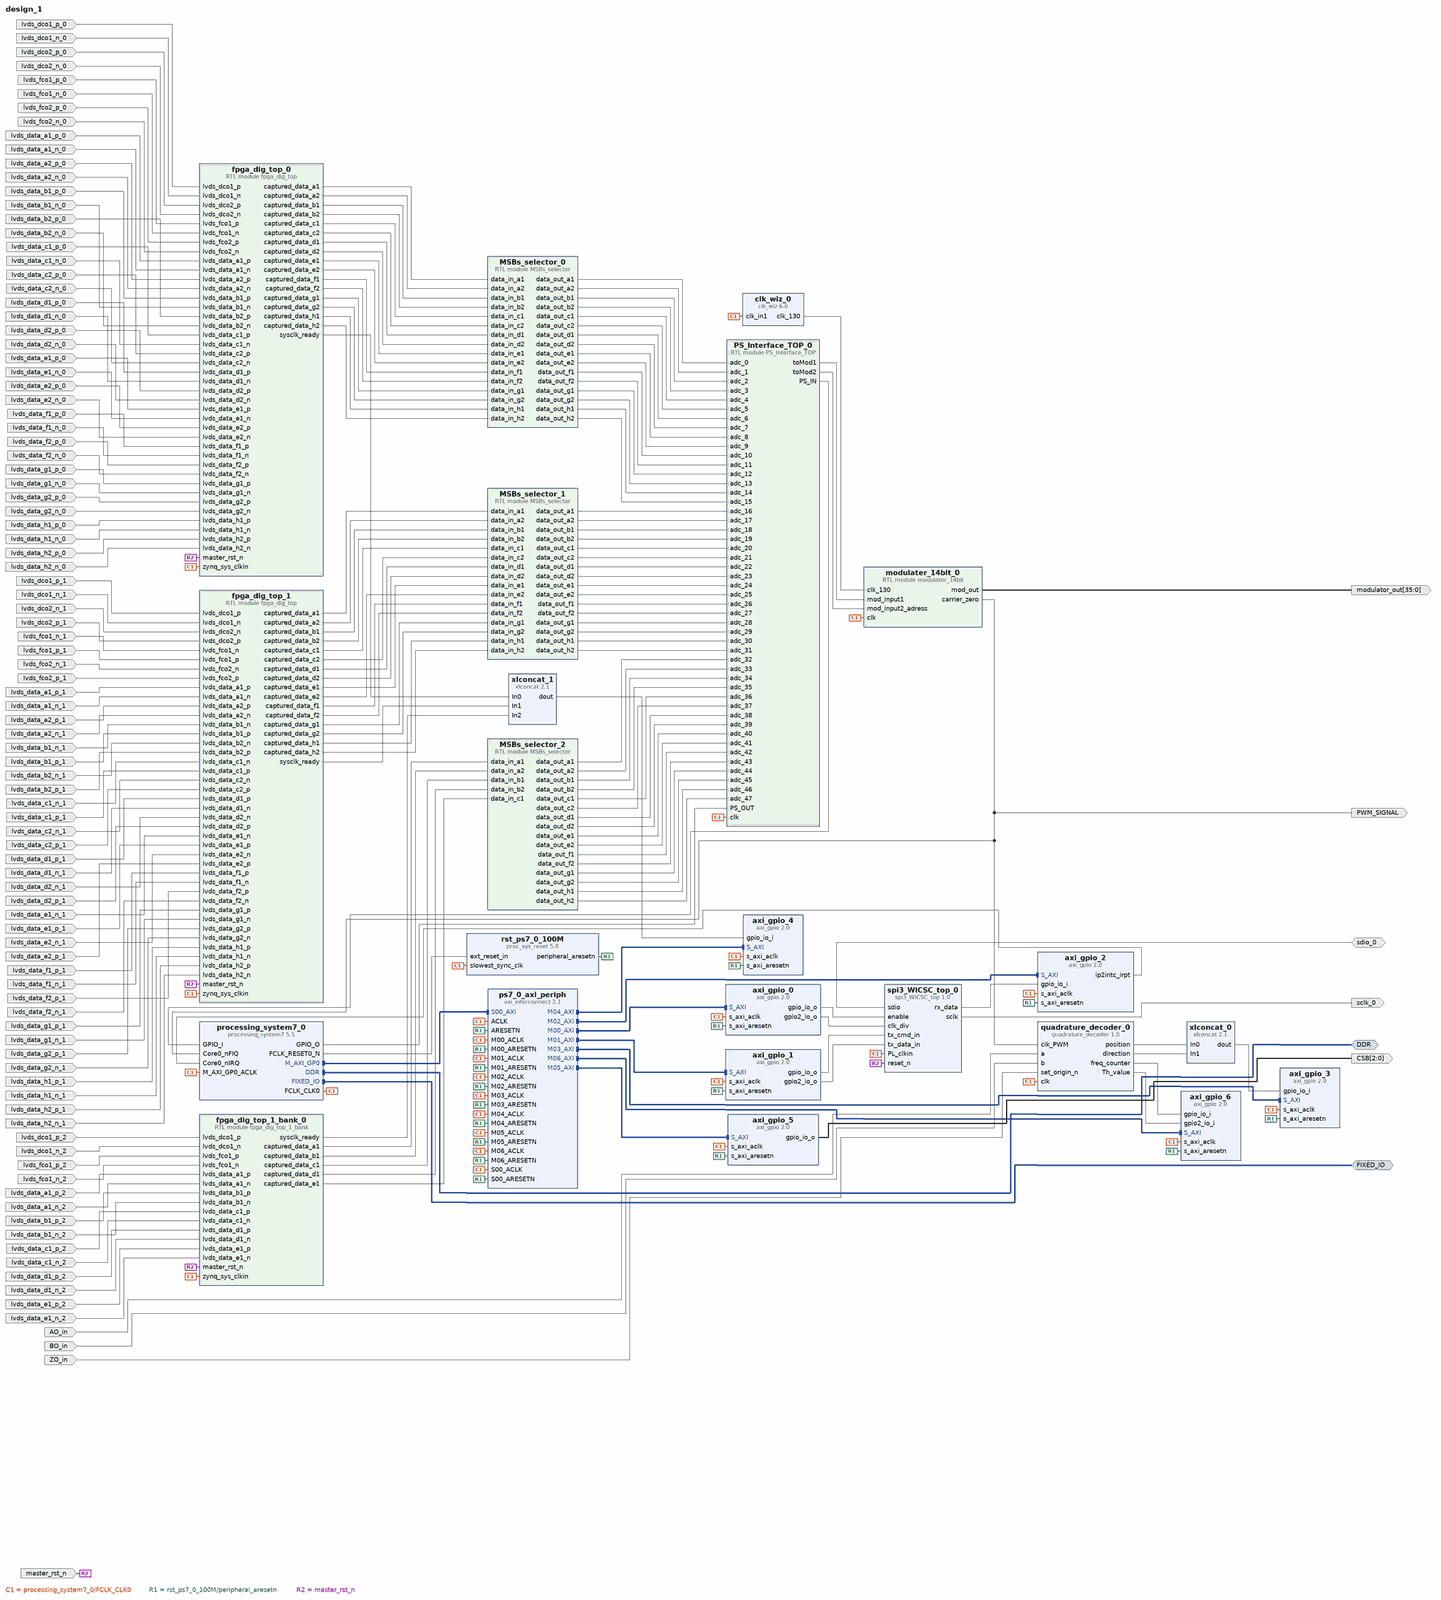
[diagram p0: block diagram of the top level, whole]
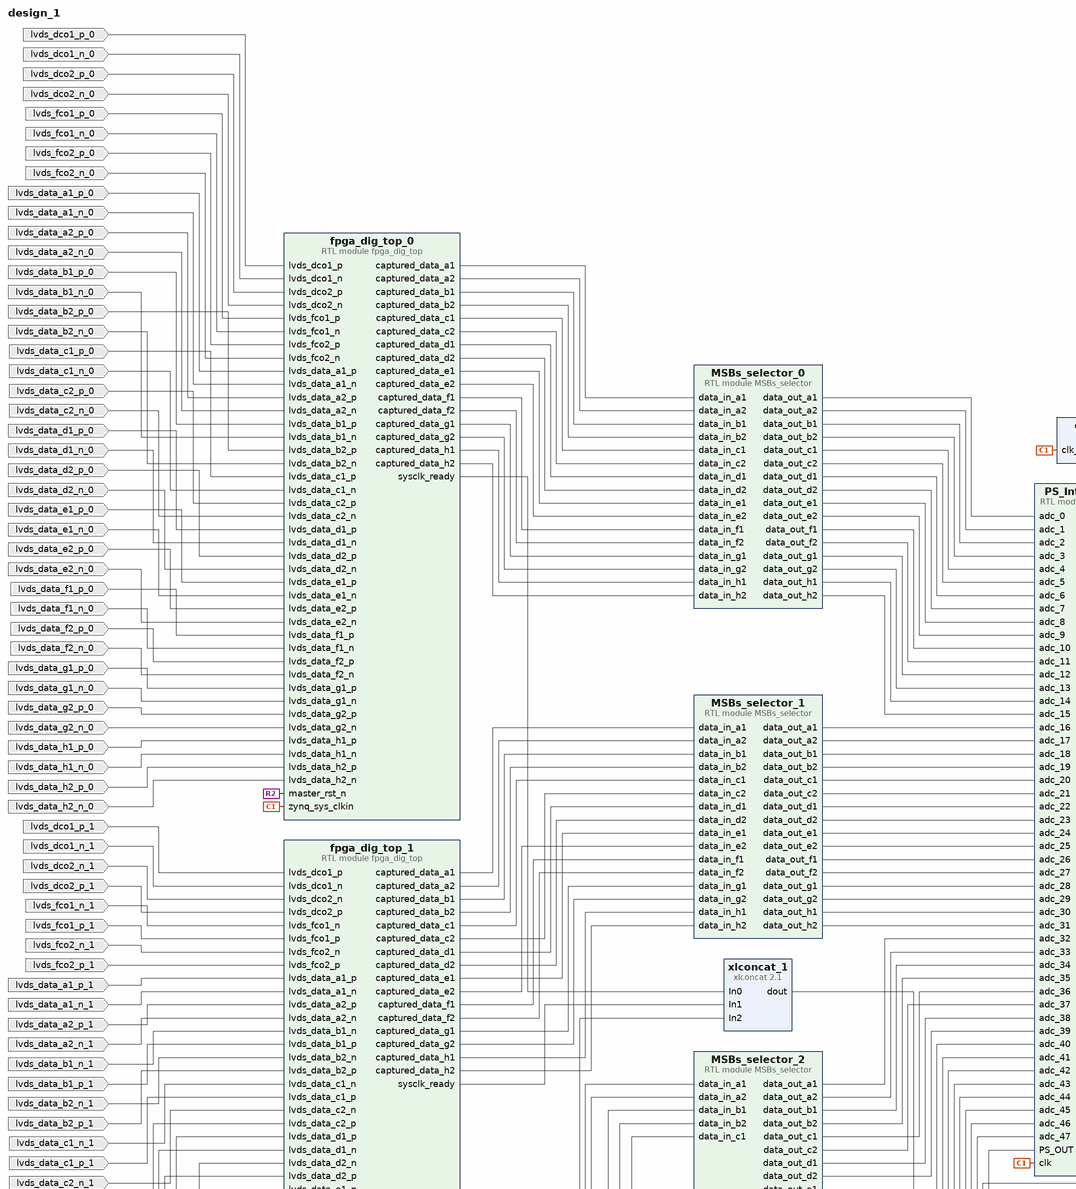
[diagram p1: block diagram of the top level, upper left part]
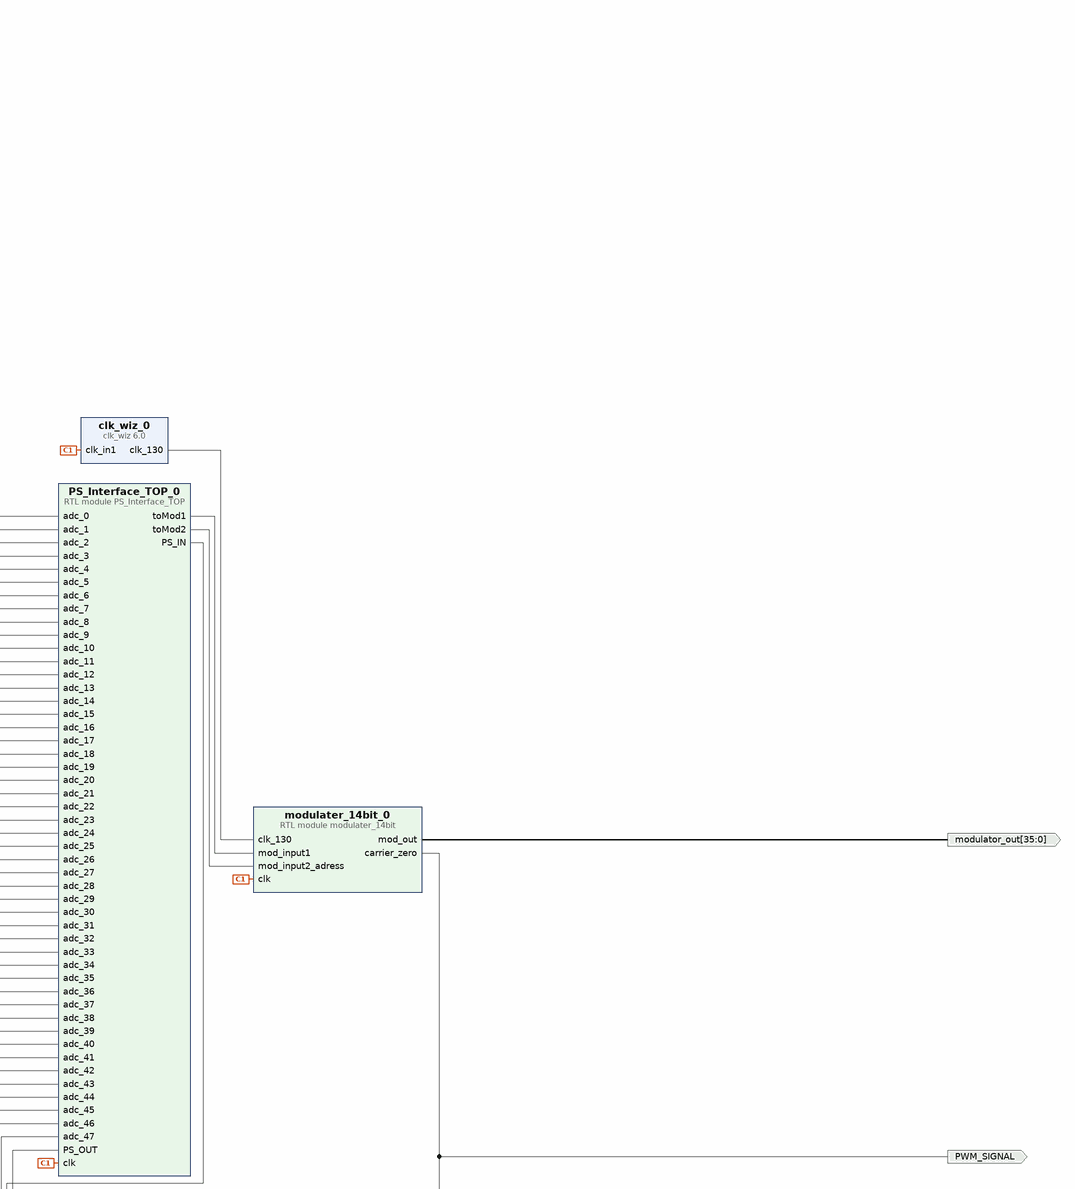
[diagram p2: block diagram of the top level, upper right part]
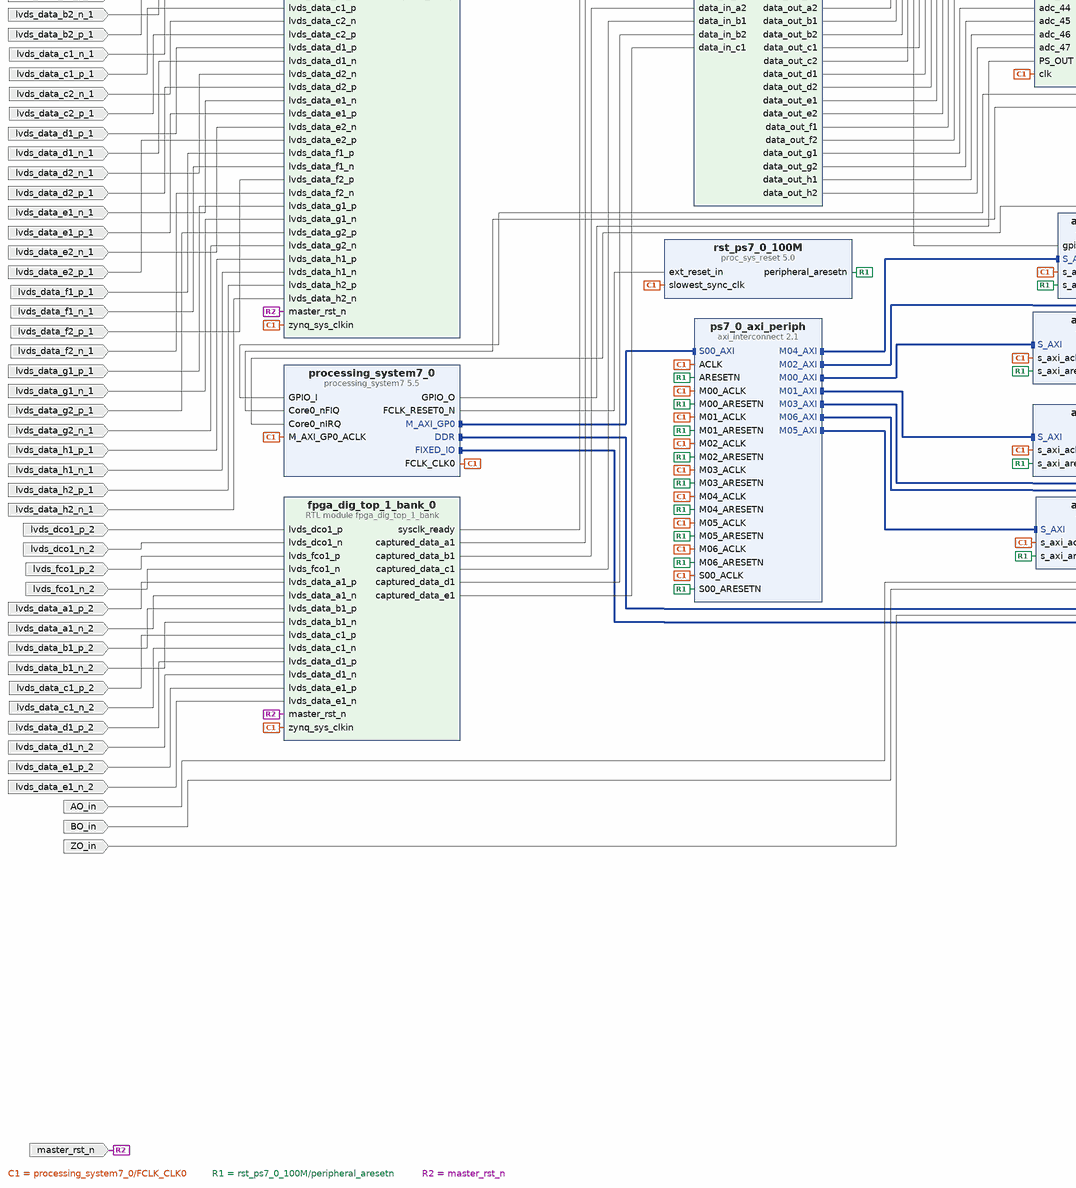
[diagram p3: block diagram of the top level, lower left part]
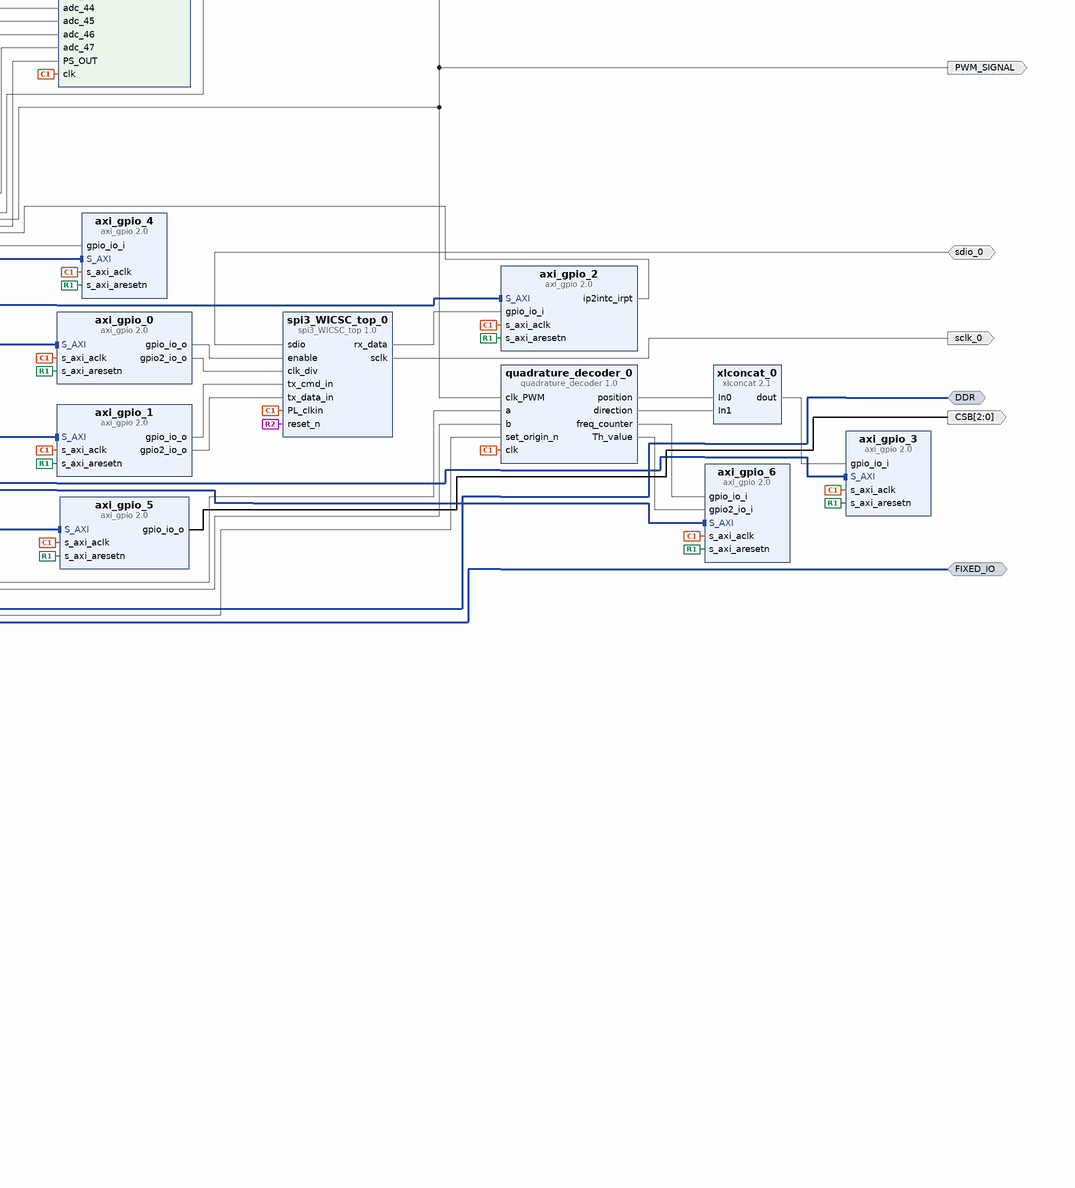
[diagram p4: block diagram of the top level, lower right part]
# Vivado block design design_1, xc7z045ffg900-2, Vivado 2020.1
create_bd_design design_1

create_bd_intf_port -mode Master -vlnv xilinx.com:interface:ddrx_rtl:1.0 DDR
create_bd_intf_port -mode Master -vlnv xilinx.com:display_processing_system7:fixedio_rtl:1.0 FIXED_IO
create_bd_port -dir I AO_in
create_bd_port -dir I BO_in
create_bd_port -dir I ZO_in
create_bd_port -dir I lvds_dco1_p_0
create_bd_port -dir I lvds_dco1_n_0
create_bd_port -dir I lvds_dco2_p_0
create_bd_port -dir I lvds_dco2_n_0
create_bd_port -dir I lvds_fco1_p_0
create_bd_port -dir I lvds_fco1_n_0
create_bd_port -dir I lvds_fco2_p_0
create_bd_port -dir I lvds_fco2_n_0
create_bd_port -dir I lvds_data_a1_p_0
create_bd_port -dir I lvds_data_a1_n_0
create_bd_port -dir I lvds_data_a2_p_0
create_bd_port -dir I lvds_data_a2_n_0
create_bd_port -dir I lvds_data_b1_p_0
create_bd_port -dir I lvds_data_b1_n_0
create_bd_port -dir I lvds_data_b2_p_0
create_bd_port -dir I lvds_data_b2_n_0
create_bd_port -dir I lvds_data_c1_p_0
create_bd_port -dir I lvds_data_c1_n_0
create_bd_port -dir I lvds_data_c2_p_0
create_bd_port -dir I lvds_data_c2_n_0
create_bd_port -dir I lvds_data_d1_p_0
create_bd_port -dir I lvds_data_d1_n_0
create_bd_port -dir I lvds_data_d2_p_0
create_bd_port -dir I lvds_data_d2_n_0
create_bd_port -dir I lvds_data_e1_p_0
create_bd_port -dir I lvds_data_e1_n_0
create_bd_port -dir I lvds_data_e2_p_0
create_bd_port -dir I lvds_data_e2_n_0
create_bd_port -dir I lvds_data_f1_p_0
create_bd_port -dir I lvds_data_f1_n_0
create_bd_port -dir I lvds_data_f2_p_0
create_bd_port -dir I lvds_data_f2_n_0
create_bd_port -dir I lvds_data_g1_p_0
create_bd_port -dir I lvds_data_g1_n_0
create_bd_port -dir I lvds_data_g2_p_0
create_bd_port -dir I lvds_data_g2_n_0
create_bd_port -dir I lvds_data_h1_p_0
create_bd_port -dir I lvds_data_h1_n_0
create_bd_port -dir I lvds_data_h2_p_0
create_bd_port -dir I lvds_data_h2_n_0
create_bd_port -dir I lvds_data_a1_n_1
create_bd_port -dir I lvds_data_a1_p_1
create_bd_port -dir I lvds_data_a2_n_1
create_bd_port -dir I lvds_data_a2_p_1
create_bd_port -dir I lvds_data_b1_n_1
create_bd_port -dir I lvds_data_b1_p_1
create_bd_port -dir I lvds_data_b2_n_1
create_bd_port -dir I lvds_data_b2_p_1
create_bd_port -dir I lvds_data_c1_n_1
create_bd_port -dir I lvds_data_c1_p_1
create_bd_port -dir I lvds_data_c2_n_1
create_bd_port -dir I lvds_data_c2_p_1
create_bd_port -dir I lvds_data_d1_n_1
create_bd_port -dir I lvds_data_d1_p_1
create_bd_port -dir I lvds_data_d2_n_1
create_bd_port -dir I lvds_data_d2_p_1
create_bd_port -dir I lvds_data_e1_n_1
create_bd_port -dir I lvds_data_e1_p_1
create_bd_port -dir I lvds_data_e2_n_1
create_bd_port -dir I lvds_data_e2_p_1
create_bd_port -dir I lvds_data_f1_n_1
create_bd_port -dir I lvds_data_f1_p_1
create_bd_port -dir I lvds_data_f2_n_1
create_bd_port -dir I lvds_data_f2_p_1
create_bd_port -dir I lvds_data_g1_n_1
create_bd_port -dir I lvds_data_g1_p_1
create_bd_port -dir I lvds_data_g2_n_1
create_bd_port -dir I lvds_data_g2_p_1
create_bd_port -dir I lvds_data_h1_n_1
create_bd_port -dir I lvds_data_h1_p_1
create_bd_port -dir I lvds_data_h2_n_1
create_bd_port -dir I lvds_data_h2_p_1
create_bd_port -dir I lvds_dco1_n_1
create_bd_port -dir I lvds_dco1_p_1
create_bd_port -dir I lvds_dco2_n_1
create_bd_port -dir I lvds_dco2_p_1
create_bd_port -dir I lvds_fco1_n_1
create_bd_port -dir I lvds_fco1_p_1
create_bd_port -dir I lvds_fco2_n_1
create_bd_port -dir I lvds_fco2_p_1
create_bd_port -dir I lvds_data_a1_n_2
create_bd_port -dir I lvds_data_a1_p_2
create_bd_port -dir I lvds_data_d1_n_2
create_bd_port -dir I lvds_data_d1_p_2
create_bd_port -dir I lvds_data_b1_n_2
create_bd_port -dir I lvds_data_b1_p_2
create_bd_port -dir I lvds_data_e1_n_2
create_bd_port -dir I lvds_data_e1_p_2
create_bd_port -dir I lvds_data_c1_n_2
create_bd_port -dir I lvds_data_c1_p_2
create_bd_port -dir I lvds_dco1_n_2
create_bd_port -dir I lvds_dco1_p_2
create_bd_port -dir I lvds_fco1_n_2
create_bd_port -dir I lvds_fco1_p_2
create_bd_port -dir IO sdio_0
create_bd_port -dir O sclk_0
create_bd_port -dir I master_rst_n
create_bd_port -dir O -from 35 -to 0 modulator_out
create_bd_port -dir O -from 2 -to 0 CSB
create_bd_port -dir O -type data PWM_SIGNAL

create_bd_cell -type ip -vlnv xilinx.com:ip:processing_system7:5.5 processing_system7_0
set_property -dict [list \
  CONFIG.PCW_APU_PERIPHERAL_FREQMHZ 667.000000 \
  CONFIG.PCW_CORE0_FIQ_INTR 1 \
  CONFIG.PCW_CORE0_IRQ_INTR 1 \
  CONFIG.PCW_DUAL_PARALLEL_QSPI_DATA_MODE x8 \
  CONFIG.PCW_ENET0_ENET0_IO {MIO 16 .. 27} \
  CONFIG.PCW_ENET0_GRP_MDIO_ENABLE 1 \
  CONFIG.PCW_ENET0_GRP_MDIO_IO {MIO 52 .. 53} \
  CONFIG.PCW_ENET0_PERIPHERAL_ENABLE 1 \
  CONFIG.PCW_ENET0_PERIPHERAL_FREQMHZ {100 Mbps} \
  CONFIG.PCW_ENET0_RESET_ENABLE 1 \
  CONFIG.PCW_ENET0_RESET_IO {MIO 47} \
  CONFIG.PCW_ENET_RESET_ENABLE 1 \
  CONFIG.PCW_ENET_RESET_SELECT {Share reset pin} \
  CONFIG.PCW_FPGA0_PERIPHERAL_FREQMHZ 100 \
  CONFIG.PCW_GPIO_EMIO_GPIO_ENABLE 1 \
  CONFIG.PCW_GPIO_EMIO_GPIO_IO 64 \
  CONFIG.PCW_GPIO_MIO_GPIO_ENABLE 1 \
  CONFIG.PCW_GPIO_MIO_GPIO_IO MIO \
  CONFIG.PCW_I2C0_GRP_INT_ENABLE 0 \
  CONFIG.PCW_I2C0_I2C0_IO {MIO 50 .. 51} \
  CONFIG.PCW_I2C0_PERIPHERAL_ENABLE 1 \
  CONFIG.PCW_I2C0_RESET_ENABLE 1 \
  CONFIG.PCW_I2C0_RESET_IO {MIO 46} \
  CONFIG.PCW_I2C_PERIPHERAL_FREQMHZ 111.111115 \
  CONFIG.PCW_I2C_RESET_ENABLE 1 \
  CONFIG.PCW_I2C_RESET_SELECT {Share reset pin} \
  CONFIG.PCW_PRESET_BANK0_VOLTAGE {LVCMOS 1.8V} \
  CONFIG.PCW_PRESET_BANK1_VOLTAGE {LVCMOS 1.8V} \
  CONFIG.PCW_QSPI_GRP_FBCLK_ENABLE 1 \
  CONFIG.PCW_QSPI_GRP_FBCLK_IO {MIO 8} \
  CONFIG.PCW_QSPI_GRP_IO1_ENABLE 1 \
  CONFIG.PCW_QSPI_GRP_IO1_IO {MIO 0 9 .. 13} \
  CONFIG.PCW_QSPI_GRP_SINGLE_SS_ENABLE 0 \
  CONFIG.PCW_QSPI_INTERNAL_HIGHADDRESS 0xFDFFFFFF \
  CONFIG.PCW_QSPI_PERIPHERAL_ENABLE 1 \
  CONFIG.PCW_QSPI_QSPI_IO {MIO 1 .. 6} \
  CONFIG.PCW_SD0_GRP_CD_ENABLE 1 \
  CONFIG.PCW_SD0_GRP_CD_IO {MIO 14} \
  CONFIG.PCW_SD0_GRP_WP_ENABLE 1 \
  CONFIG.PCW_SD0_GRP_WP_IO {MIO 15} \
  CONFIG.PCW_SD0_PERIPHERAL_ENABLE 1 \
  CONFIG.PCW_SD0_SD0_IO {MIO 40 .. 45} \
  CONFIG.PCW_SDIO_PERIPHERAL_FREQMHZ 50 \
  CONFIG.PCW_TTC0_PERIPHERAL_ENABLE 1 \
  CONFIG.PCW_TTC0_TTC0_IO EMIO \
  CONFIG.PCW_UART1_PERIPHERAL_ENABLE 1 \
  CONFIG.PCW_UART1_UART1_IO {MIO 48 .. 49} \
  CONFIG.PCW_UART_PERIPHERAL_FREQMHZ 50 \
  CONFIG.PCW_UIPARAM_DDR_FREQ_MHZ 533.333313 \
  CONFIG.PCW_UIPARAM_DDR_PARTNO Custom \
  CONFIG.PCW_USB0_PERIPHERAL_ENABLE 1 \
  CONFIG.PCW_USB0_RESET_ENABLE 1 \
  CONFIG.PCW_USB0_RESET_IO {MIO 7} \
  CONFIG.PCW_USB0_USB0_IO {MIO 28 .. 39} \
  CONFIG.PCW_USB_RESET_ENABLE 1 \
  CONFIG.PCW_USB_RESET_SELECT {Share reset pin} \
  CONFIG.PCW_USE_FABRIC_INTERRUPT 1 \
  CONFIG.preset ZC706 \
] [get_bd_cells processing_system7_0]
# 236 more settings of processing_system7_0 are not shown: defaults, MIO pin electricals, DDR timing, and values the tool derives
create_bd_cell -type module -reference fpga_dig_top fpga_dig_top_0
create_bd_cell -type ip -vlnv kth.se:user:spi3_WICSC_top:1.0 spi3_WICSC_top_0
create_bd_cell -type ip -vlnv xilinx.com:ip:axi_gpio:2.0 axi_gpio_0
set_property -dict [list \
  CONFIG.C_ALL_OUTPUTS 1 \
  CONFIG.C_ALL_OUTPUTS_2 1 \
  CONFIG.C_GPIO_WIDTH 1 \
  CONFIG.C_IS_DUAL 1 \
] [get_bd_cells axi_gpio_0]
create_bd_cell -type ip -vlnv xilinx.com:ip:axi_gpio:2.0 axi_gpio_1
set_property -dict [list \
  CONFIG.C_ALL_OUTPUTS 1 \
  CONFIG.C_ALL_OUTPUTS_2 1 \
  CONFIG.C_GPIO2_WIDTH 8 \
  CONFIG.C_GPIO_WIDTH 16 \
  CONFIG.C_IS_DUAL 1 \
] [get_bd_cells axi_gpio_1]
create_bd_cell -type ip -vlnv xilinx.com:ip:axi_gpio:2.0 axi_gpio_2
set_property -dict {CONFIG.C_ALL_INPUTS 1 CONFIG.C_GPIO_WIDTH 8 CONFIG.C_INTERRUPT_PRESENT 1} [get_bd_cells axi_gpio_2]
create_bd_cell -type ip -vlnv xilinx.com:ip:axi_interconnect:2.1 ps7_0_axi_periph
set_property -dict {CONFIG.NUM_MI 7} [get_bd_cells ps7_0_axi_periph]
create_bd_cell -type ip -vlnv xilinx.com:ip:proc_sys_reset:5.0 rst_ps7_0_100M
create_bd_cell -type module -reference PS_Interface_TOP PS_Interface_TOP_0
create_bd_cell -type module -reference modulater_14bit modulater_14bit_0
create_bd_cell -type ip -vlnv xilinx.com:ip:clk_wiz:6.0 clk_wiz_0
set_property -dict [list \
  CONFIG.CLKOUT1_JITTER 231.118 \
  CONFIG.CLKOUT1_PHASE_ERROR 297.890 \
  CONFIG.CLKOUT1_REQUESTED_OUT_FREQ 130.000 \
  CONFIG.CLK_OUT1_PORT clk_130 \
  CONFIG.MMCM_CLKFBOUT_MULT_F 50.375 \
  CONFIG.MMCM_CLKOUT0_DIVIDE_F 7.750 \
  CONFIG.MMCM_DIVCLK_DIVIDE 5 \
] [get_bd_cells clk_wiz_0]
create_bd_cell -type ip -vlnv xilinx.com:ip:axi_gpio:2.0 axi_gpio_3
set_property -dict {CONFIG.C_ALL_INPUTS 1 CONFIG.C_GPIO_WIDTH 17} [get_bd_cells axi_gpio_3]
create_bd_cell -type ip -vlnv xilinx.com:ip:xlconcat:2.1 xlconcat_0
set_property -dict {CONFIG.IN0_WIDTH 16 CONFIG.IN1_WIDTH 1} [get_bd_cells xlconcat_0]
create_bd_cell -type module -reference fpga_dig_top fpga_dig_top_1
create_bd_cell -type module -reference MSBs_selector MSBs_selector_0
create_bd_cell -type module -reference MSBs_selector MSBs_selector_1
create_bd_cell -type module -reference MSBs_selector MSBs_selector_2
create_bd_cell -type ip -vlnv xilinx.com:ip:axi_gpio:2.0 axi_gpio_4
set_property -dict {CONFIG.C_ALL_INPUTS 1 CONFIG.C_GPIO_WIDTH 3} [get_bd_cells axi_gpio_4]
create_bd_cell -type ip -vlnv xilinx.com:ip:xlconcat:2.1 xlconcat_1
set_property -dict {CONFIG.IN0_WIDTH 1 CONFIG.IN1_WIDTH 1 CONFIG.IN2_WIDTH 1 CONFIG.NUM_PORTS 3} [get_bd_cells xlconcat_1]
create_bd_cell -type module -reference fpga_dig_top_1_bank fpga_dig_top_1_bank_0
create_bd_cell -type ip -vlnv xilinx.com:ip:axi_gpio:2.0 axi_gpio_5
set_property -dict {CONFIG.C_ALL_OUTPUTS 1 CONFIG.C_DOUT_DEFAULT 0x00000003 CONFIG.C_GPIO_WIDTH 3} [get_bd_cells axi_gpio_5]
create_bd_cell -type ip -vlnv kth.se:user:quadrature_decoder:1.0 quadrature_decoder_0
set_property -dict {CONFIG.debounce_time 50000 CONFIG.set_origin_debounce_time 500000} [get_bd_cells quadrature_decoder_0]
create_bd_cell -type ip -vlnv xilinx.com:ip:axi_gpio:2.0 axi_gpio_6
set_property -dict {CONFIG.C_ALL_INPUTS 1 CONFIG.C_ALL_INPUTS_2 1 CONFIG.C_IS_DUAL 1} [get_bd_cells axi_gpio_6]

# ---- connections ----

connect_bd_intf_net [get_bd_intf_pins ps7_0_axi_periph/M02_AXI] [get_bd_intf_pins axi_gpio_2/S_AXI]
connect_bd_intf_net [get_bd_intf_pins ps7_0_axi_periph/M04_AXI] [get_bd_intf_pins axi_gpio_4/S_AXI]
connect_bd_intf_net [get_bd_intf_ports DDR] [get_bd_intf_pins processing_system7_0/DDR]
connect_bd_intf_net [get_bd_intf_pins ps7_0_axi_periph/M01_AXI] [get_bd_intf_pins axi_gpio_1/S_AXI]
connect_bd_intf_net [get_bd_intf_pins ps7_0_axi_periph/M00_AXI] [get_bd_intf_pins axi_gpio_0/S_AXI]
connect_bd_intf_net [get_bd_intf_pins ps7_0_axi_periph/M03_AXI] [get_bd_intf_pins axi_gpio_3/S_AXI]
connect_bd_intf_net [get_bd_intf_ports FIXED_IO] [get_bd_intf_pins processing_system7_0/FIXED_IO]
connect_bd_intf_net [get_bd_intf_pins ps7_0_axi_periph/M06_AXI] [get_bd_intf_pins axi_gpio_6/S_AXI]
connect_bd_intf_net [get_bd_intf_pins processing_system7_0/M_AXI_GP0] [get_bd_intf_pins ps7_0_axi_periph/S00_AXI]
connect_bd_intf_net [get_bd_intf_pins ps7_0_axi_periph/M05_AXI] [get_bd_intf_pins axi_gpio_5/S_AXI]
connect_bd_net [get_bd_pins processing_system7_0/FCLK_CLK0] \
  [get_bd_pins spi3_WICSC_top_0/PL_clkin] [get_bd_pins processing_system7_0/M_AXI_GP0_ACLK] \
  [get_bd_pins ps7_0_axi_periph/S00_ACLK] [get_bd_pins rst_ps7_0_100M/slowest_sync_clk] [get_bd_pins axi_gpio_0/s_axi_aclk] \
  [get_bd_pins ps7_0_axi_periph/M00_ACLK] [get_bd_pins ps7_0_axi_periph/ACLK] [get_bd_pins axi_gpio_1/s_axi_aclk] \
  [get_bd_pins ps7_0_axi_periph/M01_ACLK] [get_bd_pins axi_gpio_2/s_axi_aclk] [get_bd_pins ps7_0_axi_periph/M02_ACLK] \
  [get_bd_pins fpga_dig_top_0/zynq_sys_clkin] [get_bd_pins PS_Interface_TOP_0/clk] [get_bd_pins clk_wiz_0/clk_in1] \
  [get_bd_pins modulater_14bit_0/clk] [get_bd_pins axi_gpio_3/s_axi_aclk] [get_bd_pins ps7_0_axi_periph/M03_ACLK] \
  [get_bd_pins fpga_dig_top_1/zynq_sys_clkin] [get_bd_pins axi_gpio_4/s_axi_aclk] [get_bd_pins ps7_0_axi_periph/M04_ACLK] \
  [get_bd_pins fpga_dig_top_1_bank_0/zynq_sys_clkin] [get_bd_pins quadrature_decoder_0/clk] \
  [get_bd_pins axi_gpio_5/s_axi_aclk] [get_bd_pins ps7_0_axi_periph/M05_ACLK] [get_bd_pins axi_gpio_6/s_axi_aclk] \
  [get_bd_pins ps7_0_axi_periph/M06_ACLK]
connect_bd_net [get_bd_pins axi_gpio_0/gpio_io_o] [get_bd_pins spi3_WICSC_top_0/enable]
connect_bd_net [get_bd_pins axi_gpio_0/gpio2_io_o] [get_bd_pins spi3_WICSC_top_0/clk_div]
connect_bd_net [get_bd_pins axi_gpio_1/gpio_io_o] [get_bd_pins spi3_WICSC_top_0/tx_cmd_in]
connect_bd_net [get_bd_pins axi_gpio_1/gpio2_io_o] [get_bd_pins spi3_WICSC_top_0/tx_data_in]
connect_bd_net [get_bd_pins spi3_WICSC_top_0/rx_data] [get_bd_pins axi_gpio_2/gpio_io_i]
connect_bd_net [get_bd_pins processing_system7_0/FCLK_RESET0_N] [get_bd_pins rst_ps7_0_100M/ext_reset_in]
connect_bd_net [get_bd_pins rst_ps7_0_100M/peripheral_aresetn] \
  [get_bd_pins ps7_0_axi_periph/S00_ARESETN] [get_bd_pins axi_gpio_0/s_axi_aresetn] \
  [get_bd_pins ps7_0_axi_periph/M00_ARESETN] [get_bd_pins ps7_0_axi_periph/ARESETN] [get_bd_pins axi_gpio_1/s_axi_aresetn] \
  [get_bd_pins ps7_0_axi_periph/M01_ARESETN] [get_bd_pins axi_gpio_2/s_axi_aresetn] \
  [get_bd_pins ps7_0_axi_periph/M02_ARESETN] [get_bd_pins axi_gpio_3/s_axi_aresetn] \
  [get_bd_pins ps7_0_axi_periph/M03_ARESETN] [get_bd_pins axi_gpio_4/s_axi_aresetn] \
  [get_bd_pins ps7_0_axi_periph/M04_ARESETN] [get_bd_pins axi_gpio_5/s_axi_aresetn] \
  [get_bd_pins ps7_0_axi_periph/M05_ARESETN] [get_bd_pins axi_gpio_6/s_axi_aresetn] \
  [get_bd_pins ps7_0_axi_periph/M06_ARESETN]
connect_bd_net [get_bd_pins PS_Interface_TOP_0/PS_IN] [get_bd_pins processing_system7_0/GPIO_I]
connect_bd_net [get_bd_pins processing_system7_0/GPIO_O] [get_bd_pins PS_Interface_TOP_0/PS_OUT]
connect_bd_net [get_bd_pins clk_wiz_0/clk_130] [get_bd_pins modulater_14bit_0/clk_130]
connect_bd_net [get_bd_pins PS_Interface_TOP_0/toMod1] [get_bd_pins modulater_14bit_0/mod_input1]
connect_bd_net [get_bd_pins PS_Interface_TOP_0/toMod2] [get_bd_pins modulater_14bit_0/mod_input2_adress]
connect_bd_net [get_bd_pins modulater_14bit_0/carrier_zero] \
  [get_bd_pins processing_system7_0/Core0_nFIQ] [get_bd_pins quadrature_decoder_0/clk_PWM] [get_bd_ports PWM_SIGNAL]
connect_bd_net [get_bd_pins axi_gpio_2/ip2intc_irpt] [get_bd_pins processing_system7_0/Core0_nIRQ]
connect_bd_net [get_bd_pins fpga_dig_top_0/captured_data_a1] [get_bd_pins MSBs_selector_0/data_in_a1]
connect_bd_net [get_bd_pins fpga_dig_top_0/captured_data_a2] [get_bd_pins MSBs_selector_0/data_in_a2]
connect_bd_net [get_bd_pins fpga_dig_top_0/captured_data_b1] [get_bd_pins MSBs_selector_0/data_in_b1]
connect_bd_net [get_bd_pins fpga_dig_top_0/captured_data_b2] [get_bd_pins MSBs_selector_0/data_in_b2]
connect_bd_net [get_bd_pins fpga_dig_top_0/captured_data_c1] [get_bd_pins MSBs_selector_0/data_in_c1]
connect_bd_net [get_bd_pins fpga_dig_top_0/captured_data_c2] [get_bd_pins MSBs_selector_0/data_in_c2]
connect_bd_net [get_bd_pins fpga_dig_top_0/captured_data_d1] [get_bd_pins MSBs_selector_0/data_in_d1]
connect_bd_net [get_bd_pins fpga_dig_top_0/captured_data_d2] [get_bd_pins MSBs_selector_0/data_in_d2]
connect_bd_net [get_bd_pins fpga_dig_top_0/captured_data_e1] [get_bd_pins MSBs_selector_0/data_in_e1]
connect_bd_net [get_bd_pins fpga_dig_top_0/captured_data_e2] [get_bd_pins MSBs_selector_0/data_in_e2]
connect_bd_net [get_bd_pins fpga_dig_top_0/captured_data_f1] [get_bd_pins MSBs_selector_0/data_in_f1]
connect_bd_net [get_bd_pins fpga_dig_top_0/captured_data_f2] [get_bd_pins MSBs_selector_0/data_in_f2]
connect_bd_net [get_bd_pins fpga_dig_top_0/captured_data_g1] [get_bd_pins MSBs_selector_0/data_in_g1]
connect_bd_net [get_bd_pins fpga_dig_top_0/captured_data_g2] [get_bd_pins MSBs_selector_0/data_in_g2]
connect_bd_net [get_bd_pins fpga_dig_top_0/captured_data_h1] [get_bd_pins MSBs_selector_0/data_in_h1]
connect_bd_net [get_bd_pins fpga_dig_top_0/captured_data_h2] [get_bd_pins MSBs_selector_0/data_in_h2]
connect_bd_net [get_bd_pins MSBs_selector_0/data_out_a1] [get_bd_pins PS_Interface_TOP_0/adc_0]
connect_bd_net [get_bd_pins MSBs_selector_0/data_out_a2] [get_bd_pins PS_Interface_TOP_0/adc_1]
connect_bd_net [get_bd_pins MSBs_selector_0/data_out_b1] [get_bd_pins PS_Interface_TOP_0/adc_2]
connect_bd_net [get_bd_pins MSBs_selector_0/data_out_b2] [get_bd_pins PS_Interface_TOP_0/adc_3]
connect_bd_net [get_bd_pins MSBs_selector_0/data_out_c1] [get_bd_pins PS_Interface_TOP_0/adc_4]
connect_bd_net [get_bd_pins MSBs_selector_0/data_out_c2] [get_bd_pins PS_Interface_TOP_0/adc_5]
connect_bd_net [get_bd_pins MSBs_selector_0/data_out_d1] [get_bd_pins PS_Interface_TOP_0/adc_6]
connect_bd_net [get_bd_pins MSBs_selector_0/data_out_d2] [get_bd_pins PS_Interface_TOP_0/adc_7]
connect_bd_net [get_bd_pins MSBs_selector_0/data_out_e1] [get_bd_pins PS_Interface_TOP_0/adc_8]
connect_bd_net [get_bd_pins MSBs_selector_0/data_out_e2] [get_bd_pins PS_Interface_TOP_0/adc_9]
connect_bd_net [get_bd_pins MSBs_selector_0/data_out_f1] [get_bd_pins PS_Interface_TOP_0/adc_10]
connect_bd_net [get_bd_pins MSBs_selector_0/data_out_f2] [get_bd_pins PS_Interface_TOP_0/adc_11]
connect_bd_net [get_bd_pins MSBs_selector_0/data_out_g1] [get_bd_pins PS_Interface_TOP_0/adc_12]
connect_bd_net [get_bd_pins MSBs_selector_0/data_out_g2] [get_bd_pins PS_Interface_TOP_0/adc_13]
connect_bd_net [get_bd_pins MSBs_selector_0/data_out_h1] [get_bd_pins PS_Interface_TOP_0/adc_14]
connect_bd_net [get_bd_pins MSBs_selector_0/data_out_h2] [get_bd_pins PS_Interface_TOP_0/adc_15]
connect_bd_net [get_bd_pins quadrature_decoder_0/position] [get_bd_pins xlconcat_0/In0]
connect_bd_net [get_bd_pins quadrature_decoder_0/direction] [get_bd_pins xlconcat_0/In1]
connect_bd_net [get_bd_pins xlconcat_0/dout] [get_bd_pins axi_gpio_3/gpio_io_i]
connect_bd_net [get_bd_ports AO_in] [get_bd_pins quadrature_decoder_0/a]
connect_bd_net [get_bd_ports BO_in] [get_bd_pins quadrature_decoder_0/b]
connect_bd_net [get_bd_ports ZO_in] [get_bd_pins quadrature_decoder_0/set_origin_n]
connect_bd_net -net lvds_dco1_p_1_1 [get_bd_ports lvds_dco1_p_0] [get_bd_pins fpga_dig_top_0/lvds_dco1_p]
connect_bd_net -net lvds_dco1_n_1_1 [get_bd_ports lvds_dco1_n_0] [get_bd_pins fpga_dig_top_0/lvds_dco1_n]
connect_bd_net -net lvds_dco2_p_0_1 [get_bd_ports lvds_dco2_p_0] [get_bd_pins fpga_dig_top_0/lvds_dco2_p]
connect_bd_net -net lvds_dco2_n_0_1 [get_bd_ports lvds_dco2_n_0] [get_bd_pins fpga_dig_top_0/lvds_dco2_n]
connect_bd_net -net lvds_fco1_p_0_1 [get_bd_ports lvds_fco1_p_0] [get_bd_pins fpga_dig_top_0/lvds_fco1_p]
connect_bd_net -net lvds_fco1_n_0_1 [get_bd_ports lvds_fco1_n_0] [get_bd_pins fpga_dig_top_0/lvds_fco1_n]
connect_bd_net -net lvds_fco2_p_0_1 [get_bd_ports lvds_fco2_p_0] [get_bd_pins fpga_dig_top_0/lvds_fco2_p]
connect_bd_net -net lvds_fco2_n_0_1 [get_bd_ports lvds_fco2_n_0] [get_bd_pins fpga_dig_top_0/lvds_fco2_n]
connect_bd_net -net lvds_data_a1_p_0_1 [get_bd_ports lvds_data_a1_p_0] [get_bd_pins fpga_dig_top_0/lvds_data_a1_p]
connect_bd_net -net lvds_data_a1_n_0_1 [get_bd_ports lvds_data_a1_n_0] [get_bd_pins fpga_dig_top_0/lvds_data_a1_n]
connect_bd_net -net lvds_data_a2_p_0_1 [get_bd_ports lvds_data_a2_p_0] [get_bd_pins fpga_dig_top_0/lvds_data_a2_p]
connect_bd_net -net lvds_data_a2_n_0_1 [get_bd_ports lvds_data_a2_n_0] [get_bd_pins fpga_dig_top_0/lvds_data_a2_n]
connect_bd_net -net lvds_data_b1_p_0_1 [get_bd_ports lvds_data_b1_p_0] [get_bd_pins fpga_dig_top_0/lvds_data_b1_p]
connect_bd_net -net lvds_data_b1_n_0_1 [get_bd_ports lvds_data_b1_n_0] [get_bd_pins fpga_dig_top_0/lvds_data_b1_n]
connect_bd_net -net lvds_data_b2_p_0_1 [get_bd_ports lvds_data_b2_p_0] [get_bd_pins fpga_dig_top_0/lvds_data_b2_p]
connect_bd_net -net lvds_data_b2_n_0_1 [get_bd_ports lvds_data_b2_n_0] [get_bd_pins fpga_dig_top_0/lvds_data_b2_n]
connect_bd_net -net lvds_data_c1_p_0_1 [get_bd_ports lvds_data_c1_p_0] [get_bd_pins fpga_dig_top_0/lvds_data_c1_p]
connect_bd_net -net lvds_data_c1_n_0_1 [get_bd_ports lvds_data_c1_n_0] [get_bd_pins fpga_dig_top_0/lvds_data_c1_n]
connect_bd_net -net lvds_data_c2_p_0_1 [get_bd_ports lvds_data_c2_p_0] [get_bd_pins fpga_dig_top_0/lvds_data_c2_p]
connect_bd_net -net lvds_data_c2_n_0_1 [get_bd_ports lvds_data_c2_n_0] [get_bd_pins fpga_dig_top_0/lvds_data_c2_n]
connect_bd_net -net lvds_data_d1_p_0_1 [get_bd_ports lvds_data_d1_p_0] [get_bd_pins fpga_dig_top_0/lvds_data_d1_p]
connect_bd_net -net lvds_data_d1_n_0_1 [get_bd_ports lvds_data_d1_n_0] [get_bd_pins fpga_dig_top_0/lvds_data_d1_n]
connect_bd_net -net lvds_data_d2_p_0_1 [get_bd_ports lvds_data_d2_p_0] [get_bd_pins fpga_dig_top_0/lvds_data_d2_p]
connect_bd_net -net lvds_data_d2_n_0_1 [get_bd_ports lvds_data_d2_n_0] [get_bd_pins fpga_dig_top_0/lvds_data_d2_n]
connect_bd_net -net lvds_data_e1_p_0_1 [get_bd_ports lvds_data_e1_p_0] [get_bd_pins fpga_dig_top_0/lvds_data_e1_p]
connect_bd_net -net lvds_data_e1_n_0_1 [get_bd_ports lvds_data_e1_n_0] [get_bd_pins fpga_dig_top_0/lvds_data_e1_n]
connect_bd_net -net lvds_data_e2_p_0_1 [get_bd_ports lvds_data_e2_p_0] [get_bd_pins fpga_dig_top_0/lvds_data_e2_p]
connect_bd_net -net lvds_data_e2_n_0_1 [get_bd_ports lvds_data_e2_n_0] [get_bd_pins fpga_dig_top_0/lvds_data_e2_n]
connect_bd_net -net lvds_data_f1_p_0_1 [get_bd_ports lvds_data_f1_p_0] [get_bd_pins fpga_dig_top_0/lvds_data_f1_p]
connect_bd_net -net lvds_data_f1_n_0_1 [get_bd_ports lvds_data_f1_n_0] [get_bd_pins fpga_dig_top_0/lvds_data_f1_n]
connect_bd_net -net lvds_data_f2_p_0_1 [get_bd_ports lvds_data_f2_p_0] [get_bd_pins fpga_dig_top_0/lvds_data_f2_p]
connect_bd_net -net lvds_data_f2_n_0_1 [get_bd_ports lvds_data_f2_n_0] [get_bd_pins fpga_dig_top_0/lvds_data_f2_n]
connect_bd_net -net lvds_data_g1_p_0_1 [get_bd_ports lvds_data_g1_p_0] [get_bd_pins fpga_dig_top_0/lvds_data_g1_p]
connect_bd_net -net lvds_data_g1_n_0_1 [get_bd_ports lvds_data_g1_n_0] [get_bd_pins fpga_dig_top_0/lvds_data_g1_n]
connect_bd_net -net lvds_data_g2_p_0_1 [get_bd_ports lvds_data_g2_p_0] [get_bd_pins fpga_dig_top_0/lvds_data_g2_p]
connect_bd_net -net lvds_data_g2_n_0_1 [get_bd_ports lvds_data_g2_n_0] [get_bd_pins fpga_dig_top_0/lvds_data_g2_n]
connect_bd_net -net lvds_data_h1_p_0_1 [get_bd_ports lvds_data_h1_p_0] [get_bd_pins fpga_dig_top_0/lvds_data_h1_p]
connect_bd_net -net lvds_data_h1_n_0_1 [get_bd_ports lvds_data_h1_n_0] [get_bd_pins fpga_dig_top_0/lvds_data_h1_n]
connect_bd_net -net lvds_data_h2_p_0_1 [get_bd_ports lvds_data_h2_p_0] [get_bd_pins fpga_dig_top_0/lvds_data_h2_p]
connect_bd_net -net lvds_data_h2_n_0_1 [get_bd_ports lvds_data_h2_n_0] [get_bd_pins fpga_dig_top_0/lvds_data_h2_n]
connect_bd_net -net lvds_dco1_p_1_2 [get_bd_ports lvds_dco1_p_1] [get_bd_pins fpga_dig_top_1/lvds_dco1_p]
connect_bd_net -net lvds_dco1_n_1_2 [get_bd_ports lvds_dco1_n_1] [get_bd_pins fpga_dig_top_1/lvds_dco1_n]
connect_bd_net -net lvds_dco2_n_1_1 [get_bd_ports lvds_dco2_n_1] [get_bd_pins fpga_dig_top_1/lvds_dco2_n]
connect_bd_net -net lvds_dco2_p_1_1 [get_bd_ports lvds_dco2_p_1] [get_bd_pins fpga_dig_top_1/lvds_dco2_p]
connect_bd_net -net lvds_fco1_n_1_1 [get_bd_ports lvds_fco1_n_1] [get_bd_pins fpga_dig_top_1/lvds_fco1_n]
connect_bd_net -net lvds_fco1_p_1_1 [get_bd_ports lvds_fco1_p_1] [get_bd_pins fpga_dig_top_1/lvds_fco1_p]
connect_bd_net -net lvds_fco2_n_1_1 [get_bd_ports lvds_fco2_n_1] [get_bd_pins fpga_dig_top_1/lvds_fco2_n]
connect_bd_net -net lvds_fco2_p_1_1 [get_bd_ports lvds_fco2_p_1] [get_bd_pins fpga_dig_top_1/lvds_fco2_p]
connect_bd_net -net lvds_data_a1_p_1_1 [get_bd_ports lvds_data_a1_p_1] [get_bd_pins fpga_dig_top_1/lvds_data_a1_p]
connect_bd_net -net lvds_data_a1_n_1_1 [get_bd_ports lvds_data_a1_n_1] [get_bd_pins fpga_dig_top_1/lvds_data_a1_n]
connect_bd_net -net lvds_data_a2_p_1_1 [get_bd_ports lvds_data_a2_p_1] [get_bd_pins fpga_dig_top_1/lvds_data_a2_p]
connect_bd_net -net lvds_data_a2_n_1_1 [get_bd_ports lvds_data_a2_n_1] [get_bd_pins fpga_dig_top_1/lvds_data_a2_n]
connect_bd_net -net lvds_data_b1_n_1_1 [get_bd_ports lvds_data_b1_n_1] [get_bd_pins fpga_dig_top_1/lvds_data_b1_n]
connect_bd_net -net lvds_data_b1_p_1_1 [get_bd_ports lvds_data_b1_p_1] [get_bd_pins fpga_dig_top_1/lvds_data_b1_p]
connect_bd_net -net lvds_data_b2_n_1_1 [get_bd_ports lvds_data_b2_n_1] [get_bd_pins fpga_dig_top_1/lvds_data_b2_n]
connect_bd_net -net lvds_data_b2_p_1_1 [get_bd_ports lvds_data_b2_p_1] [get_bd_pins fpga_dig_top_1/lvds_data_b2_p]
connect_bd_net -net lvds_data_c1_n_1_1 [get_bd_ports lvds_data_c1_n_1] [get_bd_pins fpga_dig_top_1/lvds_data_c1_n]
connect_bd_net -net lvds_data_c1_p_1_1 [get_bd_ports lvds_data_c1_p_1] [get_bd_pins fpga_dig_top_1/lvds_data_c1_p]
connect_bd_net -net lvds_data_c2_n_1_1 [get_bd_ports lvds_data_c2_n_1] [get_bd_pins fpga_dig_top_1/lvds_data_c2_n]
connect_bd_net -net lvds_data_c2_p_1_1 [get_bd_ports lvds_data_c2_p_1] [get_bd_pins fpga_dig_top_1/lvds_data_c2_p]
connect_bd_net -net lvds_data_d1_p_1_1 [get_bd_ports lvds_data_d1_p_1] [get_bd_pins fpga_dig_top_1/lvds_data_d1_p]
connect_bd_net -net lvds_data_d1_n_1_1 [get_bd_ports lvds_data_d1_n_1] [get_bd_pins fpga_dig_top_1/lvds_data_d1_n]
connect_bd_net -net lvds_data_d2_n_1_1 [get_bd_ports lvds_data_d2_n_1] [get_bd_pins fpga_dig_top_1/lvds_data_d2_n]
connect_bd_net -net lvds_data_d2_p_1_1 [get_bd_ports lvds_data_d2_p_1] [get_bd_pins fpga_dig_top_1/lvds_data_d2_p]
connect_bd_net -net lvds_data_e1_n_1_1 [get_bd_ports lvds_data_e1_n_1] [get_bd_pins fpga_dig_top_1/lvds_data_e1_n]
connect_bd_net -net lvds_data_e1_p_1_1 [get_bd_ports lvds_data_e1_p_1] [get_bd_pins fpga_dig_top_1/lvds_data_e1_p]
connect_bd_net -net lvds_data_e2_n_1_1 [get_bd_ports lvds_data_e2_n_1] [get_bd_pins fpga_dig_top_1/lvds_data_e2_n]
connect_bd_net -net lvds_data_e2_p_1_1 [get_bd_ports lvds_data_e2_p_1] [get_bd_pins fpga_dig_top_1/lvds_data_e2_p]
connect_bd_net -net lvds_data_f1_p_1_1 [get_bd_ports lvds_data_f1_p_1] [get_bd_pins fpga_dig_top_1/lvds_data_f1_p]
connect_bd_net -net lvds_data_f1_n_1_1 [get_bd_ports lvds_data_f1_n_1] [get_bd_pins fpga_dig_top_1/lvds_data_f1_n]
connect_bd_net -net lvds_data_f2_p_1_1 [get_bd_ports lvds_data_f2_p_1] [get_bd_pins fpga_dig_top_1/lvds_data_f2_p]
connect_bd_net -net lvds_data_f2_n_1_1 [get_bd_ports lvds_data_f2_n_1] [get_bd_pins fpga_dig_top_1/lvds_data_f2_n]
connect_bd_net -net lvds_data_g1_p_1_1 [get_bd_ports lvds_data_g1_p_1] [get_bd_pins fpga_dig_top_1/lvds_data_g1_p]
connect_bd_net -net lvds_data_g1_n_1_1 [get_bd_ports lvds_data_g1_n_1] [get_bd_pins fpga_dig_top_1/lvds_data_g1_n]
connect_bd_net -net lvds_data_g2_p_1_1 [get_bd_ports lvds_data_g2_p_1] [get_bd_pins fpga_dig_top_1/lvds_data_g2_p]
connect_bd_net -net lvds_data_g2_n_1_1 [get_bd_ports lvds_data_g2_n_1] [get_bd_pins fpga_dig_top_1/lvds_data_g2_n]
connect_bd_net -net lvds_data_h1_p_1_1 [get_bd_ports lvds_data_h1_p_1] [get_bd_pins fpga_dig_top_1/lvds_data_h1_p]
connect_bd_net -net lvds_data_h1_n_1_1 [get_bd_ports lvds_data_h1_n_1] [get_bd_pins fpga_dig_top_1/lvds_data_h1_n]
connect_bd_net -net lvds_data_h2_p_1_1 [get_bd_ports lvds_data_h2_p_1] [get_bd_pins fpga_dig_top_1/lvds_data_h2_p]
connect_bd_net -net lvds_data_h2_n_1_1 [get_bd_ports lvds_data_h2_n_1] [get_bd_pins fpga_dig_top_1/lvds_data_h2_n]
connect_bd_net [get_bd_pins fpga_dig_top_1/captured_data_a1] [get_bd_pins MSBs_selector_1/data_in_a1]
connect_bd_net [get_bd_pins fpga_dig_top_1/captured_data_a2] [get_bd_pins MSBs_selector_1/data_in_a2]
connect_bd_net [get_bd_pins fpga_dig_top_1/captured_data_b1] [get_bd_pins MSBs_selector_1/data_in_b1]
connect_bd_net [get_bd_pins fpga_dig_top_1/captured_data_b2] [get_bd_pins MSBs_selector_1/data_in_b2]
connect_bd_net [get_bd_pins fpga_dig_top_1/captured_data_c1] [get_bd_pins MSBs_selector_1/data_in_c1]
connect_bd_net [get_bd_pins fpga_dig_top_1/captured_data_c2] [get_bd_pins MSBs_selector_1/data_in_c2]
connect_bd_net [get_bd_pins fpga_dig_top_1/captured_data_d1] [get_bd_pins MSBs_selector_1/data_in_d1]
connect_bd_net [get_bd_pins fpga_dig_top_1/captured_data_d2] [get_bd_pins MSBs_selector_1/data_in_d2]
connect_bd_net [get_bd_pins fpga_dig_top_1/captured_data_e1] [get_bd_pins MSBs_selector_1/data_in_e1]
connect_bd_net [get_bd_pins fpga_dig_top_1/captured_data_e2] [get_bd_pins MSBs_selector_1/data_in_e2]
connect_bd_net [get_bd_pins fpga_dig_top_1/captured_data_f1] [get_bd_pins MSBs_selector_1/data_in_f1]
connect_bd_net [get_bd_pins fpga_dig_top_1/captured_data_f2] [get_bd_pins MSBs_selector_1/data_in_f2]
connect_bd_net [get_bd_pins fpga_dig_top_1/captured_data_g1] [get_bd_pins MSBs_selector_1/data_in_g1]
connect_bd_net [get_bd_pins fpga_dig_top_1/captured_data_g2] [get_bd_pins MSBs_selector_1/data_in_g2]
connect_bd_net [get_bd_pins fpga_dig_top_1/captured_data_h1] [get_bd_pins MSBs_selector_1/data_in_h1]
connect_bd_net [get_bd_pins fpga_dig_top_1/captured_data_h2] [get_bd_pins MSBs_selector_1/data_in_h2]
connect_bd_net [get_bd_pins MSBs_selector_1/data_out_a1] [get_bd_pins PS_Interface_TOP_0/adc_16]
connect_bd_net [get_bd_pins MSBs_selector_1/data_out_a2] [get_bd_pins PS_Interface_TOP_0/adc_17]
connect_bd_net [get_bd_pins MSBs_selector_1/data_out_b1] [get_bd_pins PS_Interface_TOP_0/adc_18]
connect_bd_net [get_bd_pins MSBs_selector_1/data_out_b2] [get_bd_pins PS_Interface_TOP_0/adc_19]
connect_bd_net [get_bd_pins MSBs_selector_1/data_out_c1] [get_bd_pins PS_Interface_TOP_0/adc_20]
connect_bd_net [get_bd_pins MSBs_selector_1/data_out_c2] [get_bd_pins PS_Interface_TOP_0/adc_21]
connect_bd_net [get_bd_pins MSBs_selector_1/data_out_d1] [get_bd_pins PS_Interface_TOP_0/adc_22]
connect_bd_net [get_bd_pins MSBs_selector_1/data_out_d2] [get_bd_pins PS_Interface_TOP_0/adc_23]
connect_bd_net [get_bd_pins MSBs_selector_1/data_out_e1] [get_bd_pins PS_Interface_TOP_0/adc_24]
connect_bd_net [get_bd_pins MSBs_selector_1/data_out_e2] [get_bd_pins PS_Interface_TOP_0/adc_25]
connect_bd_net [get_bd_pins MSBs_selector_1/data_out_f1] [get_bd_pins PS_Interface_TOP_0/adc_26]
connect_bd_net [get_bd_pins MSBs_selector_1/data_out_f2] [get_bd_pins PS_Interface_TOP_0/adc_27]
connect_bd_net [get_bd_pins MSBs_selector_1/data_out_g1] [get_bd_pins PS_Interface_TOP_0/adc_28]
connect_bd_net [get_bd_pins MSBs_selector_1/data_out_g2] [get_bd_pins PS_Interface_TOP_0/adc_29]
connect_bd_net [get_bd_pins MSBs_selector_1/data_out_h1] [get_bd_pins PS_Interface_TOP_0/adc_30]
connect_bd_net [get_bd_pins MSBs_selector_1/data_out_h2] [get_bd_pins PS_Interface_TOP_0/adc_31]
connect_bd_net [get_bd_pins MSBs_selector_2/data_out_a1] [get_bd_pins PS_Interface_TOP_0/adc_32]
connect_bd_net [get_bd_pins MSBs_selector_2/data_out_a2] [get_bd_pins PS_Interface_TOP_0/adc_33]
connect_bd_net [get_bd_pins MSBs_selector_2/data_out_b1] [get_bd_pins PS_Interface_TOP_0/adc_34]
connect_bd_net [get_bd_pins MSBs_selector_2/data_out_b2] [get_bd_pins PS_Interface_TOP_0/adc_35]
connect_bd_net [get_bd_pins MSBs_selector_2/data_out_c1] [get_bd_pins PS_Interface_TOP_0/adc_36]
connect_bd_net [get_bd_pins MSBs_selector_2/data_out_c2] [get_bd_pins PS_Interface_TOP_0/adc_37]
connect_bd_net [get_bd_pins MSBs_selector_2/data_out_d1] [get_bd_pins PS_Interface_TOP_0/adc_38]
connect_bd_net [get_bd_pins MSBs_selector_2/data_out_d2] [get_bd_pins PS_Interface_TOP_0/adc_39]
connect_bd_net [get_bd_pins MSBs_selector_2/data_out_e1] [get_bd_pins PS_Interface_TOP_0/adc_40]
connect_bd_net [get_bd_pins MSBs_selector_2/data_out_e2] [get_bd_pins PS_Interface_TOP_0/adc_41]
connect_bd_net [get_bd_pins MSBs_selector_2/data_out_f1] [get_bd_pins PS_Interface_TOP_0/adc_42]
connect_bd_net [get_bd_pins MSBs_selector_2/data_out_f2] [get_bd_pins PS_Interface_TOP_0/adc_43]
connect_bd_net [get_bd_pins MSBs_selector_2/data_out_g1] [get_bd_pins PS_Interface_TOP_0/adc_44]
connect_bd_net [get_bd_pins MSBs_selector_2/data_out_g2] [get_bd_pins PS_Interface_TOP_0/adc_45]
connect_bd_net [get_bd_pins MSBs_selector_2/data_out_h1] [get_bd_pins PS_Interface_TOP_0/adc_46]
connect_bd_net [get_bd_pins MSBs_selector_2/data_out_h2] [get_bd_pins PS_Interface_TOP_0/adc_47]
connect_bd_net [get_bd_ports sdio_0] [get_bd_pins spi3_WICSC_top_0/sdio]
connect_bd_net [get_bd_pins spi3_WICSC_top_0/sclk] [get_bd_ports sclk_0]
connect_bd_net [get_bd_ports master_rst_n] \
  [get_bd_pins fpga_dig_top_0/master_rst_n] [get_bd_pins fpga_dig_top_1/master_rst_n] [get_bd_pins spi3_WICSC_top_0/reset_n] \
  [get_bd_pins fpga_dig_top_1_bank_0/master_rst_n]
connect_bd_net [get_bd_pins modulater_14bit_0/mod_out] [get_bd_ports modulator_out]
connect_bd_net [get_bd_pins xlconcat_1/dout] [get_bd_pins axi_gpio_4/gpio_io_i]
connect_bd_net [get_bd_pins fpga_dig_top_0/sysclk_ready] [get_bd_pins xlconcat_1/In0]
connect_bd_net [get_bd_pins fpga_dig_top_1/sysclk_ready] [get_bd_pins xlconcat_1/In1]
connect_bd_net -net lvds_dco1_p_2_1 [get_bd_ports lvds_dco1_p_2] [get_bd_pins fpga_dig_top_1_bank_0/lvds_dco1_p]
connect_bd_net -net lvds_dco1_n_2_1 [get_bd_ports lvds_dco1_n_2] [get_bd_pins fpga_dig_top_1_bank_0/lvds_dco1_n]
connect_bd_net -net lvds_fco1_p_2_1 [get_bd_ports lvds_fco1_p_2] [get_bd_pins fpga_dig_top_1_bank_0/lvds_fco1_p]
connect_bd_net -net lvds_fco1_n_2_1 [get_bd_ports lvds_fco1_n_2] [get_bd_pins fpga_dig_top_1_bank_0/lvds_fco1_n]
connect_bd_net -net lvds_data_a1_p_2_1 [get_bd_ports lvds_data_a1_p_2] [get_bd_pins fpga_dig_top_1_bank_0/lvds_data_a1_p]
connect_bd_net -net lvds_data_a1_n_2_1 [get_bd_ports lvds_data_a1_n_2] [get_bd_pins fpga_dig_top_1_bank_0/lvds_data_a1_n]
connect_bd_net -net lvds_data_b1_p_2_1 [get_bd_ports lvds_data_b1_p_2] [get_bd_pins fpga_dig_top_1_bank_0/lvds_data_b1_p]
connect_bd_net -net lvds_data_b1_n_2_1 [get_bd_ports lvds_data_b1_n_2] [get_bd_pins fpga_dig_top_1_bank_0/lvds_data_b1_n]
connect_bd_net -net lvds_data_c1_p_2_1 [get_bd_ports lvds_data_c1_p_2] [get_bd_pins fpga_dig_top_1_bank_0/lvds_data_c1_p]
connect_bd_net -net lvds_data_c1_n_2_1 [get_bd_ports lvds_data_c1_n_2] [get_bd_pins fpga_dig_top_1_bank_0/lvds_data_c1_n]
connect_bd_net -net lvds_data_d1_p_2_1 [get_bd_ports lvds_data_d1_p_2] [get_bd_pins fpga_dig_top_1_bank_0/lvds_data_d1_p]
connect_bd_net -net lvds_data_d1_n_2_1 [get_bd_ports lvds_data_d1_n_2] [get_bd_pins fpga_dig_top_1_bank_0/lvds_data_d1_n]
connect_bd_net -net lvds_data_e1_p_2_1 [get_bd_ports lvds_data_e1_p_2] [get_bd_pins fpga_dig_top_1_bank_0/lvds_data_e1_p]
connect_bd_net -net lvds_data_e1_n_2_1 [get_bd_ports lvds_data_e1_n_2] [get_bd_pins fpga_dig_top_1_bank_0/lvds_data_e1_n]
connect_bd_net [get_bd_pins fpga_dig_top_1_bank_0/sysclk_ready] [get_bd_pins xlconcat_1/In2]
connect_bd_net [get_bd_pins fpga_dig_top_1_bank_0/captured_data_a1] [get_bd_pins MSBs_selector_2/data_in_a1]
connect_bd_net [get_bd_pins fpga_dig_top_1_bank_0/captured_data_b1] [get_bd_pins MSBs_selector_2/data_in_a2]
connect_bd_net [get_bd_pins fpga_dig_top_1_bank_0/captured_data_c1] [get_bd_pins MSBs_selector_2/data_in_b1]
connect_bd_net [get_bd_pins fpga_dig_top_1_bank_0/captured_data_d1] [get_bd_pins MSBs_selector_2/data_in_b2]
connect_bd_net [get_bd_pins fpga_dig_top_1_bank_0/captured_data_e1] [get_bd_pins MSBs_selector_2/data_in_c1]
connect_bd_net [get_bd_pins axi_gpio_5/gpio_io_o] [get_bd_ports CSB]
connect_bd_net [get_bd_pins quadrature_decoder_0/freq_counter] [get_bd_pins axi_gpio_6/gpio_io_i]
connect_bd_net [get_bd_pins quadrature_decoder_0/Th_value] [get_bd_pins axi_gpio_6/gpio2_io_i]

# ---- address map ----
assign_bd_address -offset 0x41200000 -range 64K -target_address_space [get_bd_addr_spaces processing_system7_0/Data] [get_bd_addr_segs axi_gpio_0/S_AXI/Reg]
assign_bd_address -offset 0x41210000 -range 64K -target_address_space [get_bd_addr_spaces processing_system7_0/Data] [get_bd_addr_segs axi_gpio_1/S_AXI/Reg]
assign_bd_address -offset 0x41220000 -range 64K -target_address_space [get_bd_addr_spaces processing_system7_0/Data] [get_bd_addr_segs axi_gpio_2/S_AXI/Reg]
assign_bd_address -offset 0x41230000 -range 64K -target_address_space [get_bd_addr_spaces processing_system7_0/Data] [get_bd_addr_segs axi_gpio_3/S_AXI/Reg]
assign_bd_address -offset 0x41240000 -range 64K -target_address_space [get_bd_addr_spaces processing_system7_0/Data] [get_bd_addr_segs axi_gpio_4/S_AXI/Reg]
assign_bd_address -offset 0x41250000 -range 64K -target_address_space [get_bd_addr_spaces processing_system7_0/Data] [get_bd_addr_segs axi_gpio_5/S_AXI/Reg]
assign_bd_address -offset 0x41260000 -range 64K -target_address_space [get_bd_addr_spaces processing_system7_0/Data] [get_bd_addr_segs axi_gpio_6/S_AXI/Reg]

validate_bd_design
save_bd_design
